# EAGLE design OSCILLO18313R3 (EAGLE 4.16)
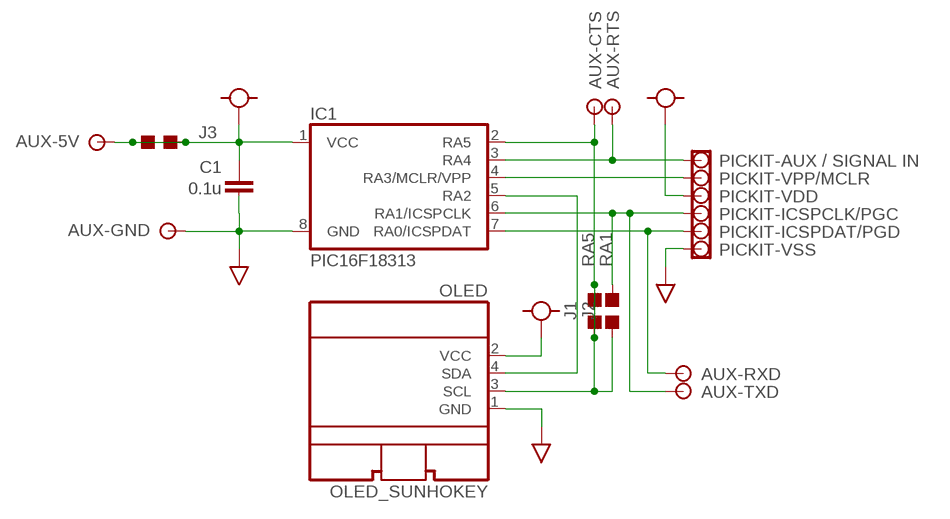
[diagram p0: schematic, sheet 1]

## Parts
AUX-  TTL-232R-5V  [TTL-232R-5V]
C1  0.1u  C-CERAMIC  [C025-025X050]
IC1  PIC16F18313  [DIL08]
J1  SOLPAD  [SOLPAD]
J2  SOLPAD  [SOLPAD]
J3  SOLPAD  [SOLPAD]
OLED  OLED_SUNHOKEY  [OLED_SUNHOKEY]
PICKIT-  PICKIT2  [PICKIT2]

## Nets
GND: AUX-.1 C1.2 IC1.8(GND) OLED.1(GND) PICKIT-.3
N$1: IC1.4(RA3/MCLR/VPP) PICKIT-.1
N$11: IC1.5(RA2) OLED.4(SDA)
RA0: AUX-.5 IC1.7(RA0/ICSPDAT) PICKIT-.4
RA1: AUX-.4 IC1.6(RA1/ICSPCLK) J2.2 PICKIT-.5
RA4: AUX-.6 IC1.3(RA4) PICKIT-.6
RA5: AUX-.2 IC1.2(RA5) J1.1 J1.2 J2.1 OLED.3(SCL)
VCC: AUX-.3 C1.1 IC1.1(VCC) J3.1 J3.2 OLED.2(VCC) PICKIT-.2

## Notes on the sheet
- / SIGNAL IN

## Library data of the parts
AUX- = OSCILLO18313R3:TTL-232R-5V
C1 = OSCILLO18313R3:C-CERAMIC: Ceramic Conenser
IC1 = OSCILLO18313R3:PIC16F18313
J1-J3 = OSCILLO18313R3:SOLPAD
OLED = OSCILLO18313R3:OLED_SUNHOKEY
PICKIT- = OSCILLO18313R3:PICKIT2

## Board
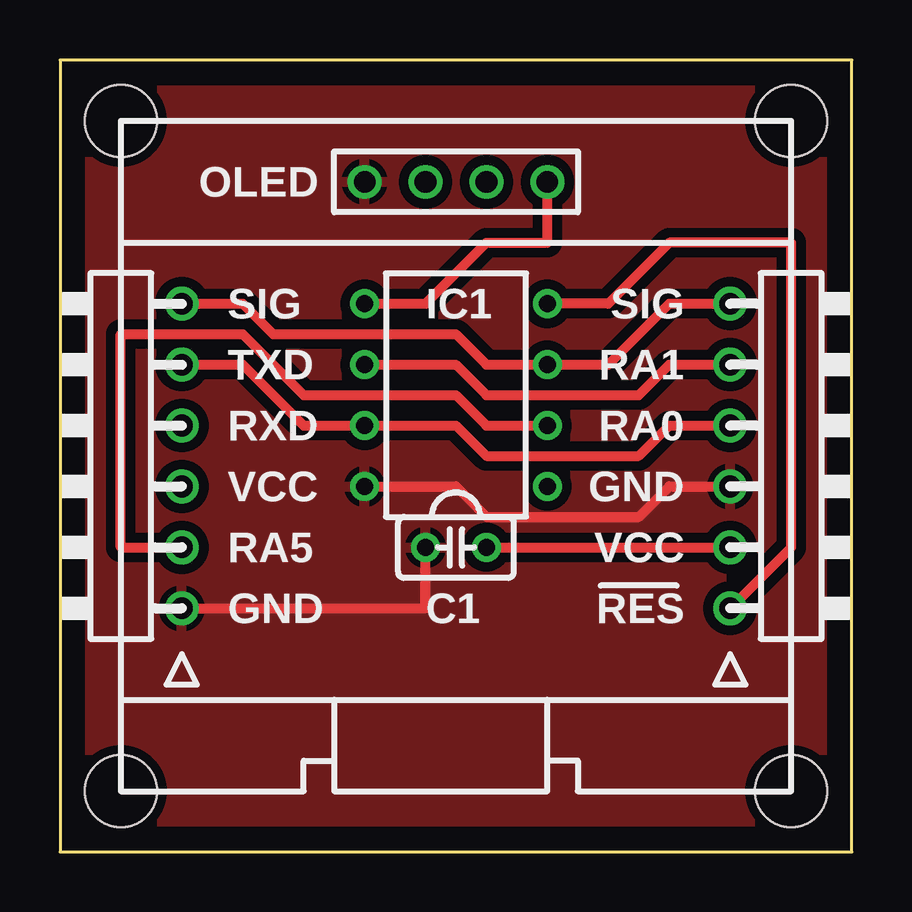
[diagram p1: board, top side]
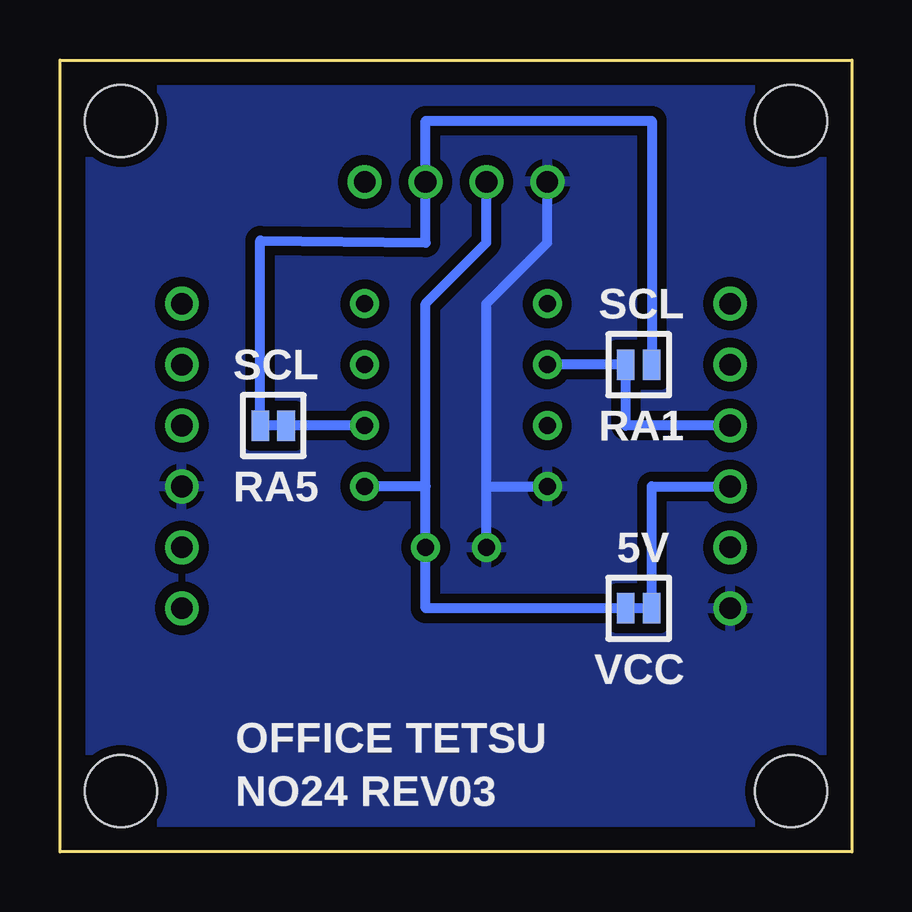
[diagram p2: board, bottom side, seen from below]

Size 33.02 x 33.02 mm. Coordinates in mm from the lower left corner, seen from the top.
Outline: 0,33.02 0,0 33.02,0 33.02,33.02 0,33.02
Copper layers (1*16): Top 0.035mm / dielectric 1.5mm / Bottom 0.035mm
Design rules "OfficeTETSUstandard": minimum track width 6mil, minimum drill 12mil, track to track 6mil, track to pad 6mil, pad to pad 6mil, via to via 6mil, smd to smd 0mil, copper to edge 10mil, drill to drill 10mil, minimum pad ring 10mil, minimum via ring 6mil, stop-mask expansion 2mil, vias tented up to drill 25mil, thermal gap 10mil
Holes 3 mm at 2.54,30.48 2.54,2.54 30.48,2.54 30.48,30.48

### Footprints (pad centres in the part's own frame; a part is rotated, then mirrored left to right if it is on the bottom)
TTL-232R-5V = drill 0.9 round: 1 -6.35,0; 2 -3.81,0; 3 -1.27,0; 4 1.27,0; 5 3.81,0; 6 6.35,0
C025-025X050 = drill 0.7 round: 1 -1.27,0; 2 1.27,0
DIL08 = drill 0.7 round: 1 -3.81,-3.81; 2 -1.27,-3.81; 3 1.27,-3.81; 4 3.81,-3.81; 5 3.81,3.81; 6 1.27,3.81; 7 -1.27,3.81; 8 -3.81,3.81
SOLPAD = smd 0.736 x 1.27: 1 -0.54,0; 2 0.54,0
OLED_SUNHOKEY = drill 0.9 round: 1 -3.81,10.16; 2 -1.27,10.16; 3 1.27,10.16; 4 3.81,10.16
PICKIT2 = drill 0.9 round: 1 5.08,0; 2 2.54,0; 3 0,0; 4 -2.54,0; 5 -5.08,0; 6 -7.62,0

### Placement (x,y rotation side)
AUX-  5.08,16.51 90 top
C1  16.51,12.7 180 top
IC1  16.51,19.05 90 top
J1  24.13,17.78 0 bottom
J2  8.89,20.32 180 bottom
J3  8.89,10.16 180 bottom
OLED  16.51,17.78 0 top
PICKIT-  27.94,15.24 270 top

### Tracks (layer width: path | path; a pad name or v marks a point on that pad's centre or on a via)
GND
  Top 0.406: PICKIT-.3 25.4,15.24 24.13,13.97 17.78,13.97 16.51,15.24 IC1.8 | AUX-.1 15.24,10.16 C1.2
  Bottom 0.406: C1.2 15.24,15.24 | 15.24,15.24 15.24,22.86 12.7,25.4 OLED.1 | 15.24,15.24 IC1.8
  pour Bottom (isolate 0.406): 1.27,31.75 31.75,31.75 31.75,1.27 1.27,1.27
  pour Top (isolate 0.406): 1.27,31.75 31.75,31.75 31.75,1.27 1.27,1.27
N$1
  Top 0.406: IC1.4 22.86,22.86 25.4,25.4 30.48,25.4 30.48,12.7 PICKIT-.1
N$11
  Top 0.406: IC1.5 15.24,22.86 17.78,25.4 20.32,25.4 OLED.4
RA0
  Top 0.406: PICKIT-.4 25.4,17.78 24.13,16.51 17.78,16.51 16.51,17.78 IC1.7 10.16,17.78 7.62,20.32 AUX-.5
RA1
  Top 0.406: IC1.6 16.51,20.32 17.78,19.05 24.13,19.05 25.4,20.32 PICKIT-.5
  Bottom 0.406: IC1.6 J2.2 9.43,17.78 AUX-.4
RA4
  Top 0.406: PICKIT-.6 25.4,22.86 22.86,20.32 IC1.3 17.78,20.32 16.51,21.59 8.89,21.59 7.62,22.86 AUX-.6
RA5
  Top 0.406: AUX-.2 2.54,12.7 2.54,21.59 7.62,21.59 10.16,19.05 16.51,19.05 17.78,17.78 IC1.2
  Bottom 0.406: IC1.2 J1.2 J1.1 24.67,25.5 17.78,25.4 OLED.3 17.78,30.48 8.35,30.48 J2.1
VCC
  Top 0.406: C1.1 PICKIT-.2
  Bottom 0.406: 17.78,15.24 C1.1 17.78,10.16 J3.2 J3.1 8.35,15.24 AUX-.3 | 17.78,15.24 17.78,22.86 15.24,25.4 OLED.2 | 17.78,15.24 IC1.1

### Text on the board
tPlace: OLED | SIG | SIG | IC1 | RA1 | TXD | RA0 | RXD | GND | VCC | VCC | RA5 | RES | GND | C1
bPlace: SCL | SCL | RA1 | RA5 | 5V | VCC | OFFICE TETSU | NO24 REV03